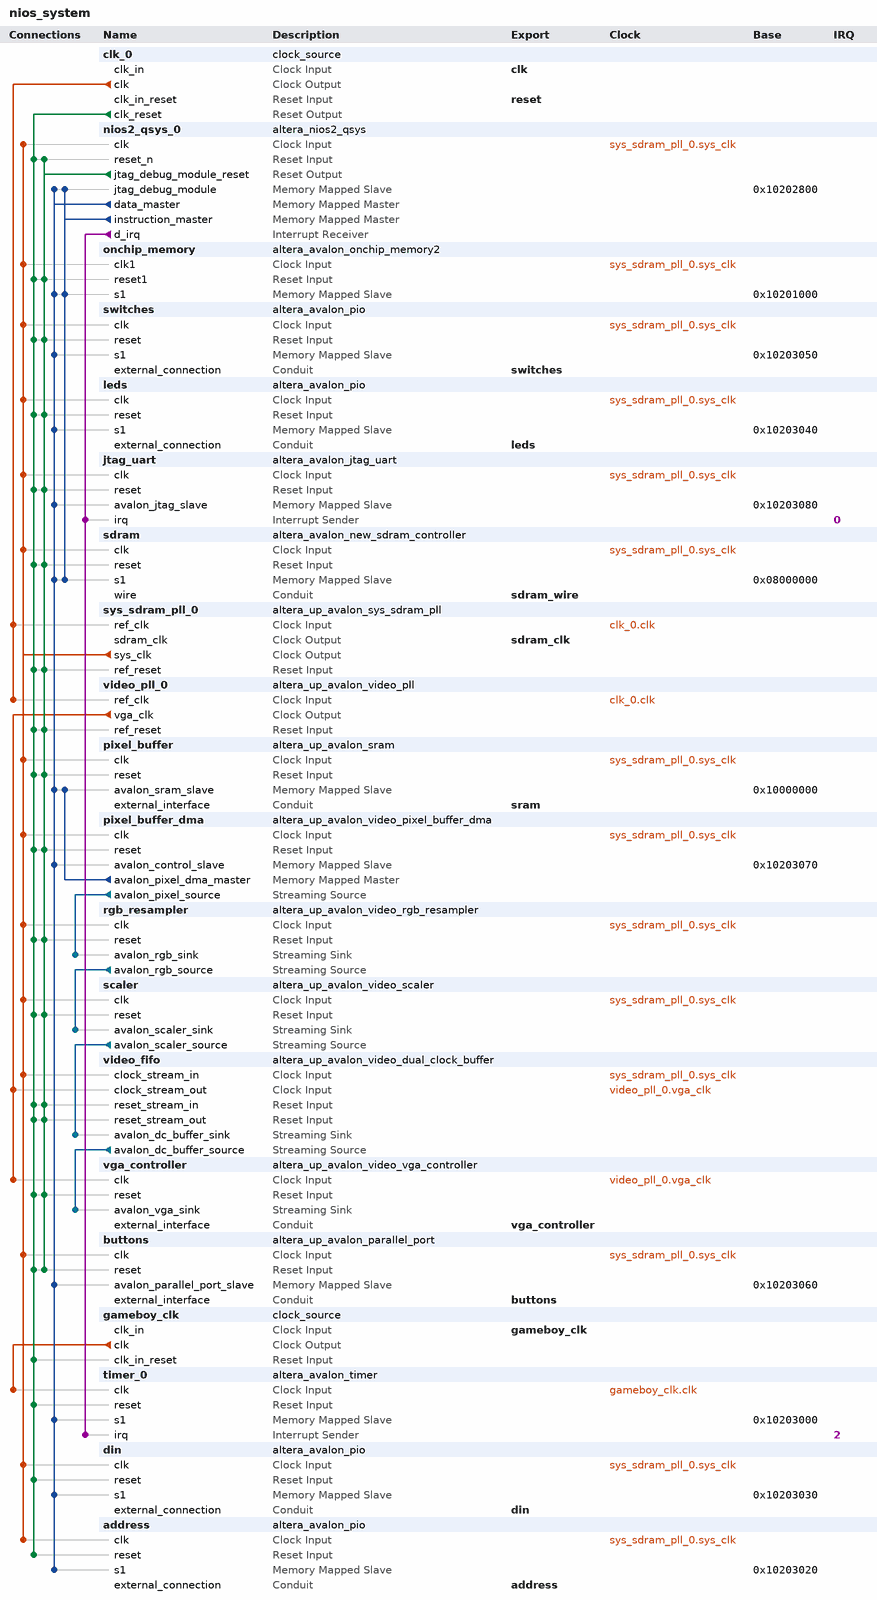
[diagram p0: system contents]
# Platform Designer (Qsys) system nios_system, Cyclone IV E EP4CE115F29C7
# Parameters at their usual value, and those the tool derives, are not listed.
package require -exact qsys 15.1
create_system nios_system
set_project_property DEVICE_FAMILY {Cyclone IV E}
set_project_property DEVICE EP4CE115F29C7

add_instance clk_0 clock_source 15.1
set_instance_parameter_value clk_0 clockFrequency 50000000

add_instance nios2_qsys_0 altera_nios2_qsys 15.1
set_instance_parameter_value nios2_qsys_0 breakSlave nios2_qsys_0.jtag_debug_module
set_instance_parameter_value nios2_qsys_0 exceptionSlave onchip_memory.s1
set_instance_parameter_value nios2_qsys_0 icache_size 4096
set_instance_parameter_value nios2_qsys_0 impl Fast
set_instance_parameter_value nios2_qsys_0 mmu_TLBMissExcSlave None
set_instance_parameter_value nios2_qsys_0 resetSlave onchip_memory.s1
set_instance_parameter_value nios2_qsys_0 resetrequest_enabled true

add_instance onchip_memory altera_avalon_onchip_memory2 15.1
set_instance_parameter_value onchip_memory dataWidth 32
set_instance_parameter_value onchip_memory dualPort false
set_instance_parameter_value onchip_memory initMemContent true
set_instance_parameter_value onchip_memory initializationFileName onchip_memory
set_instance_parameter_value onchip_memory memorySize 4096

add_instance switches altera_avalon_pio 15.1
set_instance_parameter_value switches direction Input
set_instance_parameter_value switches width 18

add_instance leds altera_avalon_pio 15.1
set_instance_parameter_value leds direction Output
set_instance_parameter_value leds width 8

add_instance jtag_uart altera_avalon_jtag_uart 15.1
set_instance_parameter_value jtag_uart simInteractiveOptions INTERACTIVE_ASCII_OUTPUT

add_instance sdram altera_avalon_new_sdram_controller 15.1
set_instance_parameter_value sdram TAC 5.5
set_instance_parameter_value sdram TRCD 20.0
set_instance_parameter_value sdram TRP 20.0
set_instance_parameter_value sdram casLatency 3
set_instance_parameter_value sdram columnWidth 10
set_instance_parameter_value sdram dataWidth 32
set_instance_parameter_value sdram generateSimulationModel false
set_instance_parameter_value sdram model custom
set_instance_parameter_value sdram numberOfBanks 4
set_instance_parameter_value sdram numberOfChipSelects 1
set_instance_parameter_value sdram powerUpDelay 100.0
set_instance_parameter_value sdram refreshPeriod 15.625
set_instance_parameter_value sdram rowWidth 13

add_instance sys_sdram_pll_0 altera_up_avalon_sys_sdram_pll 15.1
set_instance_parameter_value sys_sdram_pll_0 CV_boards DE1-SoC
set_instance_parameter_value sys_sdram_pll_0 gui_outclk 50.0
set_instance_parameter_value sys_sdram_pll_0 gui_refclk 50.0

add_instance video_pll_0 altera_up_avalon_video_pll 15.1
set_instance_parameter_value video_pll_0 camera {5MP Digital Camera}
set_instance_parameter_value video_pll_0 gui_refclk 50.0
set_instance_parameter_value video_pll_0 lcd {7" LCD on VEEK-MT and MTL Module}

add_instance pixel_buffer altera_up_avalon_sram 15.1
set_instance_parameter_value pixel_buffer board DE2-115
set_instance_parameter_value pixel_buffer pixel_buffer true

add_instance pixel_buffer_dma altera_up_avalon_video_pixel_buffer_dma 15.1
set_instance_parameter_value pixel_buffer_dma addr_mode Consecutive
set_instance_parameter_value pixel_buffer_dma back_start_address 0
set_instance_parameter_value pixel_buffer_dma color_space {16-bit RGB}
set_instance_parameter_value pixel_buffer_dma image_height 240
set_instance_parameter_value pixel_buffer_dma image_width 320
set_instance_parameter_value pixel_buffer_dma start_address 0

add_instance rgb_resampler altera_up_avalon_video_rgb_resampler 15.1
set_instance_parameter_value rgb_resampler alpha 1023
set_instance_parameter_value rgb_resampler input_type {16-bit RGB}
set_instance_parameter_value rgb_resampler output_type {30-bit RGB}

add_instance scaler altera_up_avalon_video_scaler 15.1
set_instance_parameter_value scaler color_bits 10
set_instance_parameter_value scaler color_planes 3
set_instance_parameter_value scaler height_scaling 2
set_instance_parameter_value scaler width_in 320
set_instance_parameter_value scaler width_scaling 2

add_instance video_fifo altera_up_avalon_video_dual_clock_buffer 15.1
set_instance_parameter_value video_fifo color_bits 10

add_instance vga_controller altera_up_avalon_video_vga_controller 15.1
set_instance_parameter_value vga_controller board DE2-115
set_instance_parameter_value vga_controller resolution {VGA 640x480}

add_instance buttons altera_up_avalon_parallel_port 15.1
set_instance_parameter_value buttons board DE2-115
set_instance_parameter_value buttons capture false
set_instance_parameter_value buttons edge Rising
set_instance_parameter_value buttons irq false
set_instance_parameter_value buttons preset Pushbuttons

add_instance gameboy_clk clock_source 15.1
set_instance_parameter_value gameboy_clk clockFrequency 4166666

add_instance timer_0 altera_avalon_timer 15.1
set_instance_parameter_value timer_0 period 5
set_instance_parameter_value timer_0 periodUnits CLOCKS

add_instance din altera_avalon_pio 15.1
set_instance_parameter_value din direction Input
set_instance_parameter_value din width 8

add_instance address altera_avalon_pio 15.1
set_instance_parameter_value address direction Output
set_instance_parameter_value address width 16

# connections
add_connection clk_0.clk sys_sdram_pll_0.ref_clk clock
add_connection clk_0.clk video_pll_0.ref_clk clock
add_connection gameboy_clk.clk timer_0.clk clock
add_connection sys_sdram_pll_0.sys_clk address.clk clock
add_connection sys_sdram_pll_0.sys_clk buttons.clk clock
add_connection sys_sdram_pll_0.sys_clk din.clk clock
add_connection sys_sdram_pll_0.sys_clk jtag_uart.clk clock
add_connection sys_sdram_pll_0.sys_clk leds.clk clock
add_connection sys_sdram_pll_0.sys_clk nios2_qsys_0.clk clock
add_connection sys_sdram_pll_0.sys_clk onchip_memory.clk1 clock
add_connection sys_sdram_pll_0.sys_clk pixel_buffer.clk clock
add_connection sys_sdram_pll_0.sys_clk pixel_buffer_dma.clk clock
add_connection sys_sdram_pll_0.sys_clk rgb_resampler.clk clock
add_connection sys_sdram_pll_0.sys_clk scaler.clk clock
add_connection sys_sdram_pll_0.sys_clk sdram.clk clock
add_connection sys_sdram_pll_0.sys_clk switches.clk clock
add_connection sys_sdram_pll_0.sys_clk video_fifo.clock_stream_in clock
add_connection video_pll_0.vga_clk vga_controller.clk clock
add_connection video_pll_0.vga_clk video_fifo.clock_stream_out clock
add_connection clk_0.clk_reset address.reset reset
add_connection clk_0.clk_reset buttons.reset reset
add_connection clk_0.clk_reset din.reset reset
add_connection clk_0.clk_reset gameboy_clk.clk_in_reset reset
add_connection clk_0.clk_reset jtag_uart.reset reset
add_connection clk_0.clk_reset leds.reset reset
add_connection clk_0.clk_reset nios2_qsys_0.reset_n reset
add_connection clk_0.clk_reset onchip_memory.reset1 reset
add_connection clk_0.clk_reset pixel_buffer.reset reset
add_connection clk_0.clk_reset pixel_buffer_dma.reset reset
add_connection clk_0.clk_reset rgb_resampler.reset reset
add_connection clk_0.clk_reset scaler.reset reset
add_connection clk_0.clk_reset sdram.reset reset
add_connection clk_0.clk_reset switches.reset reset
add_connection clk_0.clk_reset sys_sdram_pll_0.ref_reset reset
add_connection clk_0.clk_reset timer_0.reset reset
add_connection clk_0.clk_reset vga_controller.reset reset
add_connection clk_0.clk_reset video_fifo.reset_stream_in reset
add_connection clk_0.clk_reset video_fifo.reset_stream_out reset
add_connection clk_0.clk_reset video_pll_0.ref_reset reset
add_connection nios2_qsys_0.jtag_debug_module_reset buttons.reset reset
add_connection nios2_qsys_0.jtag_debug_module_reset jtag_uart.reset reset
add_connection nios2_qsys_0.jtag_debug_module_reset leds.reset reset
add_connection nios2_qsys_0.jtag_debug_module_reset nios2_qsys_0.reset_n reset
add_connection nios2_qsys_0.jtag_debug_module_reset onchip_memory.reset1 reset
add_connection nios2_qsys_0.jtag_debug_module_reset pixel_buffer.reset reset
add_connection nios2_qsys_0.jtag_debug_module_reset pixel_buffer_dma.reset reset
add_connection nios2_qsys_0.jtag_debug_module_reset rgb_resampler.reset reset
add_connection nios2_qsys_0.jtag_debug_module_reset scaler.reset reset
add_connection nios2_qsys_0.jtag_debug_module_reset sdram.reset reset
add_connection nios2_qsys_0.jtag_debug_module_reset switches.reset reset
add_connection nios2_qsys_0.jtag_debug_module_reset sys_sdram_pll_0.ref_reset reset
add_connection nios2_qsys_0.jtag_debug_module_reset vga_controller.reset reset
add_connection nios2_qsys_0.jtag_debug_module_reset video_fifo.reset_stream_in reset
add_connection nios2_qsys_0.jtag_debug_module_reset video_fifo.reset_stream_out reset
add_connection nios2_qsys_0.jtag_debug_module_reset video_pll_0.ref_reset reset
add_connection nios2_qsys_0.data_master address.s1 avalon
set_connection_parameter_value nios2_qsys_0.data_master/address.s1 baseAddress 0x10203020
add_connection nios2_qsys_0.data_master buttons.avalon_parallel_port_slave avalon
set_connection_parameter_value nios2_qsys_0.data_master/buttons.avalon_parallel_port_slave baseAddress 0x10203060
add_connection nios2_qsys_0.data_master din.s1 avalon
set_connection_parameter_value nios2_qsys_0.data_master/din.s1 baseAddress 0x10203030
add_connection nios2_qsys_0.data_master jtag_uart.avalon_jtag_slave avalon
set_connection_parameter_value nios2_qsys_0.data_master/jtag_uart.avalon_jtag_slave baseAddress 0x10203080
add_connection nios2_qsys_0.data_master leds.s1 avalon
set_connection_parameter_value nios2_qsys_0.data_master/leds.s1 baseAddress 0x10203040
add_connection nios2_qsys_0.data_master nios2_qsys_0.jtag_debug_module avalon
set_connection_parameter_value nios2_qsys_0.data_master/nios2_qsys_0.jtag_debug_module baseAddress 0x10202800
add_connection nios2_qsys_0.data_master onchip_memory.s1 avalon
set_connection_parameter_value nios2_qsys_0.data_master/onchip_memory.s1 baseAddress 0x10201000
add_connection nios2_qsys_0.data_master pixel_buffer.avalon_sram_slave avalon
set_connection_parameter_value nios2_qsys_0.data_master/pixel_buffer.avalon_sram_slave baseAddress 0x10000000
add_connection nios2_qsys_0.data_master pixel_buffer_dma.avalon_control_slave avalon
set_connection_parameter_value nios2_qsys_0.data_master/pixel_buffer_dma.avalon_control_slave baseAddress 0x10203070
add_connection nios2_qsys_0.data_master sdram.s1 avalon
set_connection_parameter_value nios2_qsys_0.data_master/sdram.s1 baseAddress 0x08000000
add_connection nios2_qsys_0.data_master switches.s1 avalon
set_connection_parameter_value nios2_qsys_0.data_master/switches.s1 baseAddress 0x10203050
add_connection nios2_qsys_0.data_master timer_0.s1 avalon
set_connection_parameter_value nios2_qsys_0.data_master/timer_0.s1 baseAddress 0x10203000
add_connection nios2_qsys_0.instruction_master nios2_qsys_0.jtag_debug_module avalon
set_connection_parameter_value nios2_qsys_0.instruction_master/nios2_qsys_0.jtag_debug_module baseAddress 0x10202800
add_connection nios2_qsys_0.instruction_master onchip_memory.s1 avalon
set_connection_parameter_value nios2_qsys_0.instruction_master/onchip_memory.s1 baseAddress 0x10201000
add_connection nios2_qsys_0.instruction_master sdram.s1 avalon
set_connection_parameter_value nios2_qsys_0.instruction_master/sdram.s1 baseAddress 0x08000000
add_connection pixel_buffer_dma.avalon_pixel_dma_master pixel_buffer.avalon_sram_slave avalon
set_connection_parameter_value pixel_buffer_dma.avalon_pixel_dma_master/pixel_buffer.avalon_sram_slave baseAddress 0x10000000
add_connection pixel_buffer_dma.avalon_pixel_source rgb_resampler.avalon_rgb_sink avalon_streaming
add_connection rgb_resampler.avalon_rgb_source scaler.avalon_scaler_sink avalon_streaming
add_connection scaler.avalon_scaler_source video_fifo.avalon_dc_buffer_sink avalon_streaming
add_connection video_fifo.avalon_dc_buffer_source vga_controller.avalon_vga_sink avalon_streaming
add_connection nios2_qsys_0.d_irq jtag_uart.irq interrupt
set_connection_parameter_value nios2_qsys_0.d_irq/jtag_uart.irq irqNumber 0
add_connection nios2_qsys_0.d_irq timer_0.irq interrupt
set_connection_parameter_value nios2_qsys_0.d_irq/timer_0.irq irqNumber 2

# exported interfaces
add_interface address conduit end
set_interface_property address EXPORT_OF address.external_connection
add_interface buttons conduit end
set_interface_property buttons EXPORT_OF buttons.external_interface
add_interface clk clock sink
set_interface_property clk EXPORT_OF clk_0.clk_in
add_interface din conduit end
set_interface_property din EXPORT_OF din.external_connection
add_interface gameboy_clk clock sink
set_interface_property gameboy_clk EXPORT_OF gameboy_clk.clk_in
add_interface leds conduit end
set_interface_property leds EXPORT_OF leds.external_connection
add_interface reset reset sink
set_interface_property reset EXPORT_OF clk_0.clk_in_reset
add_interface sdram_clk clock source
set_interface_property sdram_clk EXPORT_OF sys_sdram_pll_0.sdram_clk
add_interface sdram_wire conduit end
set_interface_property sdram_wire EXPORT_OF sdram.wire
add_interface sram conduit end
set_interface_property sram EXPORT_OF pixel_buffer.external_interface
add_interface switches conduit end
set_interface_property switches EXPORT_OF switches.external_connection
add_interface vga_controller conduit end
set_interface_property vga_controller EXPORT_OF vga_controller.external_interface

set_interconnect_requirement {$system} qsys_mm.clockCrossingAdapter HANDSHAKE
set_interconnect_requirement {$system} qsys_mm.maxAdditionalLatency 1

save_system nios_system.qsys
